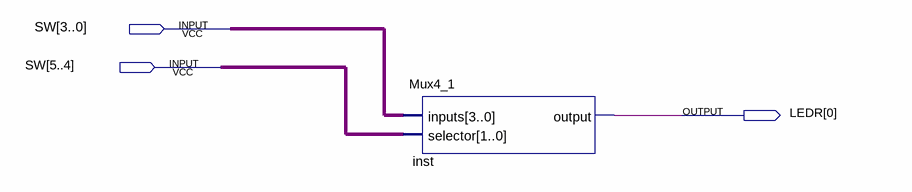
[diagram p0: schematic sheet]
// Quartus schematic Mux4_1Demo.bdf as structural Verilog: 1 symbols, 3 pins
module Mux4_1Demo (
  input  [5:0] SW,
  output [0:0] LEDR
);

  Mux4_1 inst (.inputs(SW[3:0]), .selector(SW[5:4]), .\output (LEDR[0]));
endmodule
